# EAGLE design AST1012 (EAGLE 6.3)
DATABASE: ./../../../../../Components/TinyCircuits_Part_Database.txt
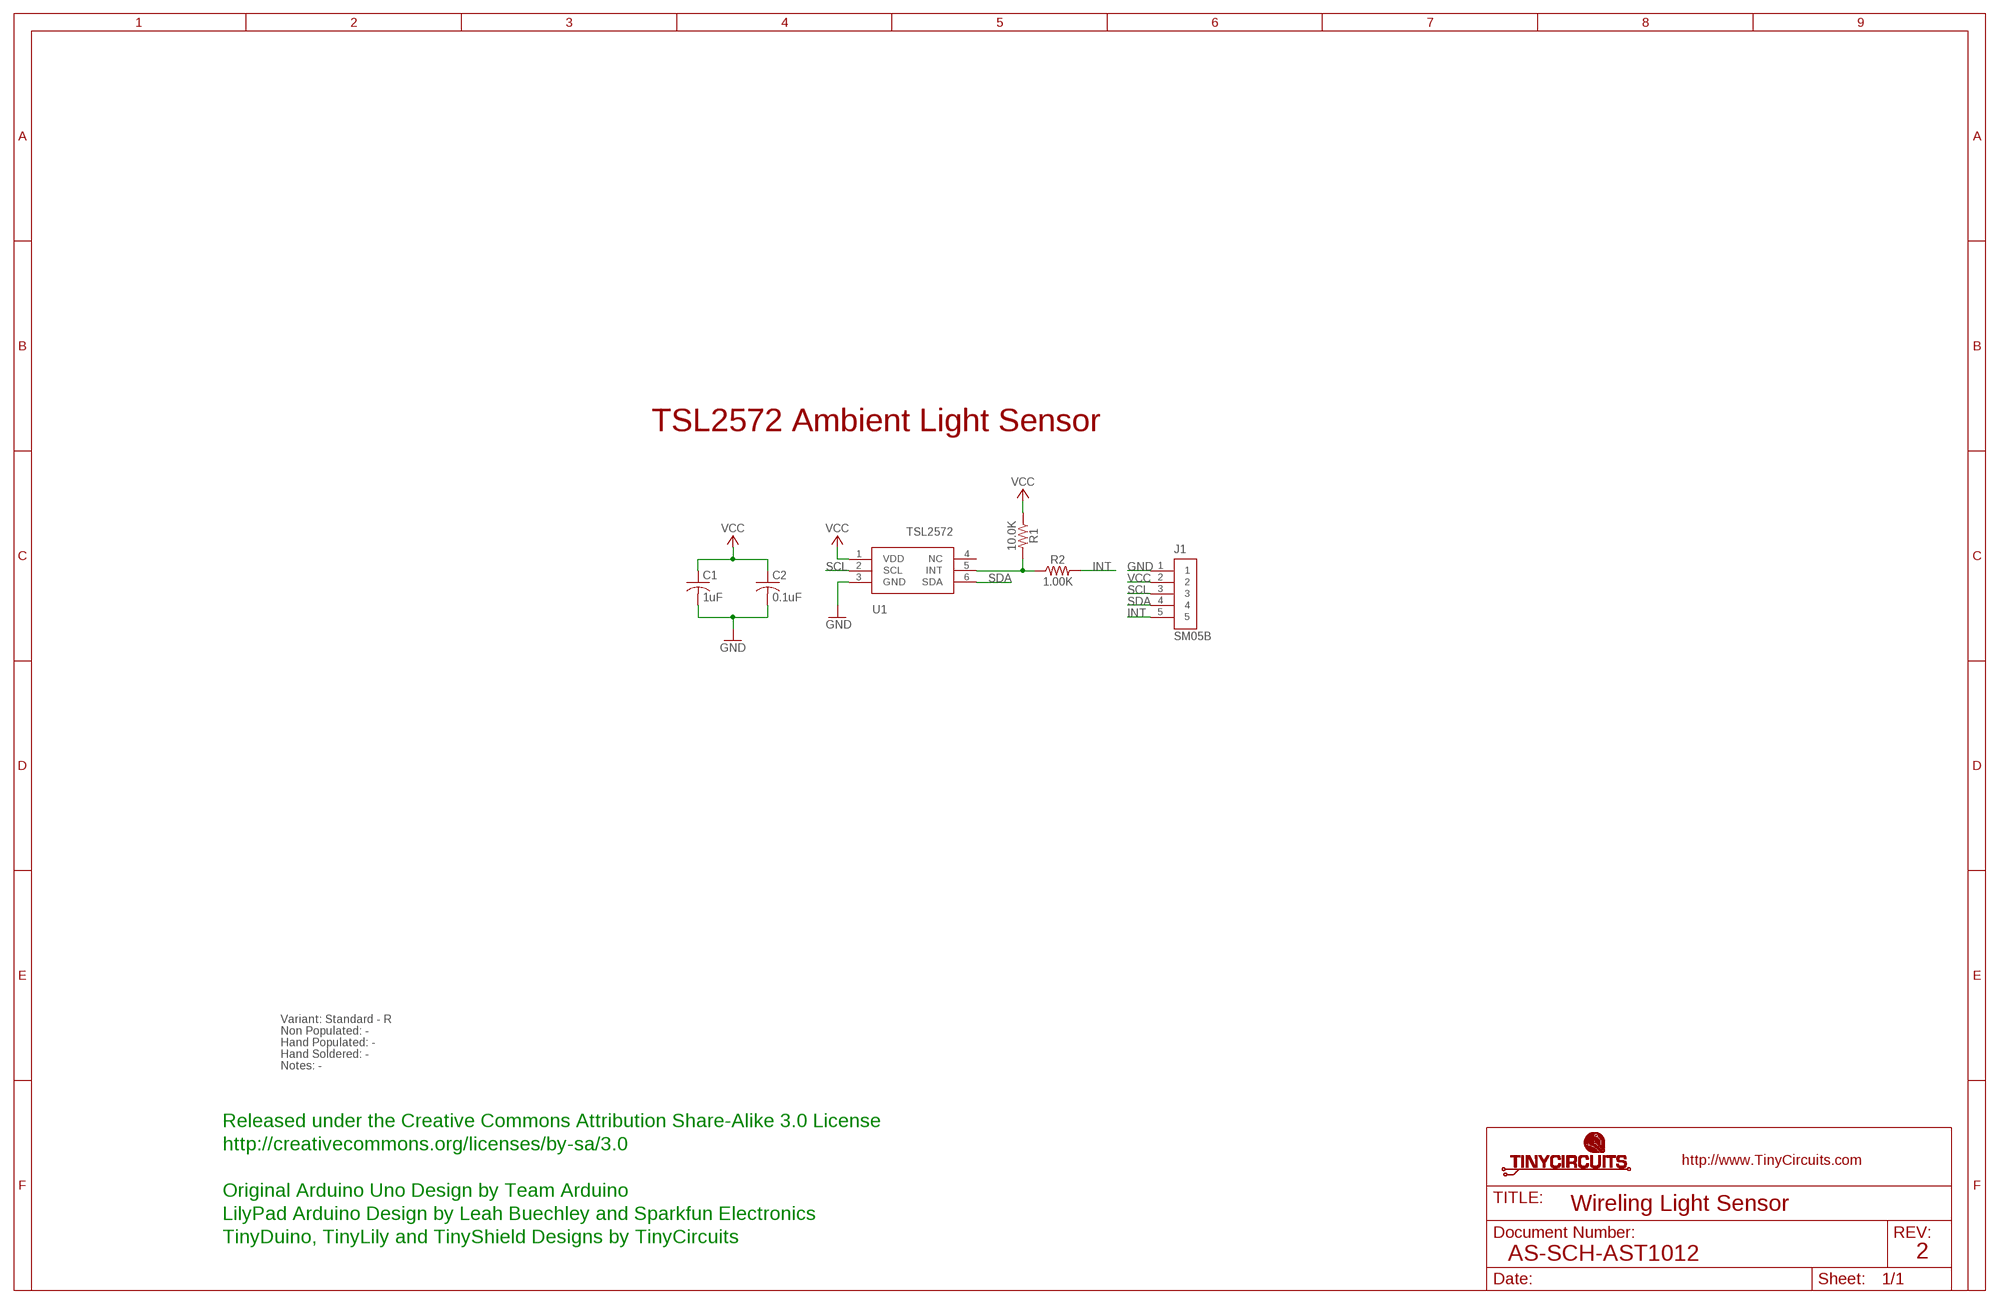
[diagram p0: schematic, sheet 1]

## Parts
C1  1uF  AS-ITM-00410  [C0603]
C2  0.1uF  AS-ITM-00008  [C0402]
J1  SM05B  AS-ITM-00340EDGE  [JST_SH_5X1_EDGE]
R1  10.0K  AS-ITM-00032  [0402]
R2  1.00K  AS-ITM-00003  [0402]
U1  TSL2572  AS-ITM-00116  [TSL2572]

## Nets
GND: C1.2 C2.2 J1.1 U1.3(GND)
GPIO1: R1.2 R2.1 U1.5(INT)
INT: J1.5 R2.2
SCL: J1.3 U1.2(SCL)
SDA: J1.4 U1.6(SDA)
VCC: C1.1 C2.1 J1.2 R1.1 U1.1(VDD)
Unconnected: U1.4(NC)

## Notes on the sheet
- TSL2572 Ambient Light Sensor
- Variant: Standard - R
- Non Populated: -
- Hand Populated: -
- Hand Soldered: -
- Notes: -
- Released under the Creative Commons Attribution Share-Alike 3.0 License
- http://creativecommons.org/licenses/by-sa/3.0
- Original Arduino Uno Design by Team Arduino
- Wireling Light Sensor
- LilyPad Arduino Design by Leah Buechley and Sparkfun Electronics
- TinyDuino, TinyLily and TinyShield Designs by TinyCircuits
- AS-SCH-AST1012 | 2

## Library data of the parts
C1 = tinycircuits:AS-ITM-00410: CAP CER 1UF 10V X5R 0603; PARTNO: AS-ITM-00410
C2 = tinycircuits:AS-ITM-00008: CAP CER 0.1UF 16V 10% X5R 0402; PARTNO: AS-ITM-00008
J1 = tinycircuits:AS-ITM-00340: CONN HEADER SH 5POS SIDE 1MM TIN; PARTNO: AS-ITM-00340; PNPROTATION: 180
R1 = tinycircuits:AS-ITM-00032: RES 10.0K OHM 1/16W 1% 0402 SMD; PARTNO: AS-ITM-00032
R2 = tinycircuits:AS-ITM-00003: RES 1.00K OHM 1/16W 1% 0402; PARTNO: AS-ITM-00003
U1 = tinycircuits:AS-ITM-00116: Light-To-Digital Converter, TSL2572; PARTNO: AS-ITM-00116

## Net classes
2 gnd: width 0.305 mm, drill 0.559 mm, clearance 0.254 mm

## Board
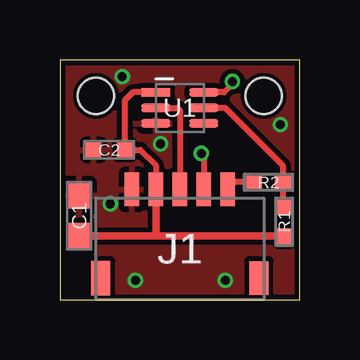
[diagram p1: board, top side]
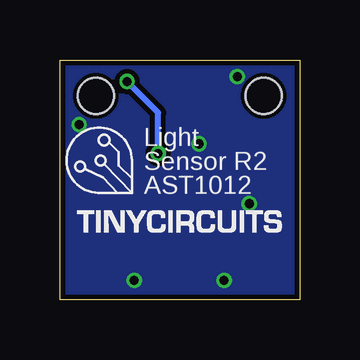
[diagram p2: board, bottom side, seen from below]

Size 10 x 10 mm. Coordinates in mm from the lower left corner, seen from the top.
Outline: 0,0 10,0 10,10 0,10 0,0
Copper layers (1*16): Top 0.035mm / dielectric 1.5mm / Bottom 0.035mm
Design rules "default *": minimum track width 8mil, minimum drill 15mil, track to track 8mil, track to pad 8mil, pad to pad 8mil, via to via 8mil, smd to smd 8mil, copper to edge 8mil, drill to drill 8mil, minimum pad ring 8mil, minimum via ring 5mil, stop-mask expansion 4mil, vias tented up to drill 25mil, thermal gap 10mil
Holes 1.5 mm at 1.5,8.5 8.5,8.5

### Footprints (pad centres in the part's own frame; a part is rotated, then mirrored left to right if it is on the bottom)
C0603 = smd 1.1 x 1: 1 -0.85,0; 2 0.85,0
C0402 = smd 0.65 x 0.6: 1 -0.65,0; 2 0.65,0
JST_SH_5X1_EDGE = smd 0.6 x 1.4: 1 -2,2.475; 2 -1,2.475; 3 0,2.475; 4 1,2.475; 5 2,2.475 | smd 0.8 x 1.4: PAD1 -3.3,-1.225; PAD2 3.3,-1.225
0402 = smd 0.65 x 0.55: 1 -0.6,0; 2 0.6,0
TSL2572 = smd 1.2 x 0.35: 1 -1,0.65; 2 -1,0; 3 -1,-0.65; 4 1,-0.65; 5 1,0; 6 1,0.65

### Placement (x,y rotation side)
C1  0.8,3.5 90 top
C2  2.05,6.25 180 top
J1  5,2.12 0 top
R1  9.35,3.25 90 top
R2  8.7,4.9 180 top
U1  5,8 0 top
U$1  [DOCFIELD-TINYCIRCUITS-PCB]  19,-10 0 top  (outside the outline)

### Tracks (layer width: path | path; a pad name or v marks a point on that pad's centre or on a via)
GND  (via drill 0.38)
  other vias: 6.9,0.8 9.2,7.3 3.15,0.8 2.6,9.3 2.1,4 4.2,6.5
  pour Bottom: 0,10 10,10 10,0 0,0
  pour Top: 0,10 10,10 10,0 0,0
GPIO1
  Top 0.254: U1.5 6.9,8 9.3,5.6 R2.1 9.3,3.9 R1.2
INT
  Top 0.254: R2.2 7.3,4.9 J1.5
SCL
  Top 0.254: U1.2 4.9,8 5,7.9 J1.3
SDA  (via drill 0.38)
  Top 0.254: J1.4 6,6 v5.9,6.1 | v7.2,9.1 7.2,9 6.85,8.65 U1.6
  Bottom 0.254: v5.9,6.1 5.9,7.8 v7.2,9.1
VCC
  Top 0.254: U1.1 3.05,8.65 2.7,8.3 C2.1 3.35,6.25 4,5.6 J1.2
  Top 0.305: C1.1 3.9,2.65 | 3.9,2.65 R1.1 | J1.2 4,2.75 3.9,2.65

### Text on the board
bPlace: Light | Sensor R2 | AST1012
Document: FABRICATION DRAWING | NOTES: | 1. PRINTED CIRCUIT BOARD MADE FROM NEMA GRADE FR-4 EPOXY LAMINATE | WITH 1 OUNCE COPPER PLATING AND .024 THICKNESS. | 2. ALL DIMENSIONS ARE GIVEN IN MILLIMETERS. | 3. CIRCUIT PATHS ARE FOR REFERENCE ONLY. | 4. HOLE SIZES SHOWN ARE FINISHED DIAMETERS AFTER PLATING. | 5. BOARD PLATED USING REFLOW OR SIMILAR METHOD. | 6. BOARD TO HAVE BLUE SOLDER MASK ON PLATED SURFACES USING WET FILM | 7. SILKSCREEN BOARD USING WHITE INK. | SR100 OR SR1010 EPOXY. EQUIVALENT WET OR DRY FILM MAY BE USED. | 8. THE FOLLOWING INFORMATION APPLIES TO THIS BOARD: | * 2 COPPER LAYERS | * .024 BOARD THICKNESS | * REQUIRES TOP SIDE SILKSCREEN | Released under the Creative Commons Attribution Share-Alike 3.0 License | http://creativecommons.org/licenses/by-sa/3.0 | Original Arduino Uno Design by Team Arduino | LilyPad Arduino Design by Leah Buechley and Sparkfun Electronics | TinyDuino, TinyLily and TinyShield Designs by TinyCircuits | Wireling Light Sensor | AS-PCB-AST1012 | 2